# EAGLE design FLC-148 ptt panel (EAGLE 9.4.0)
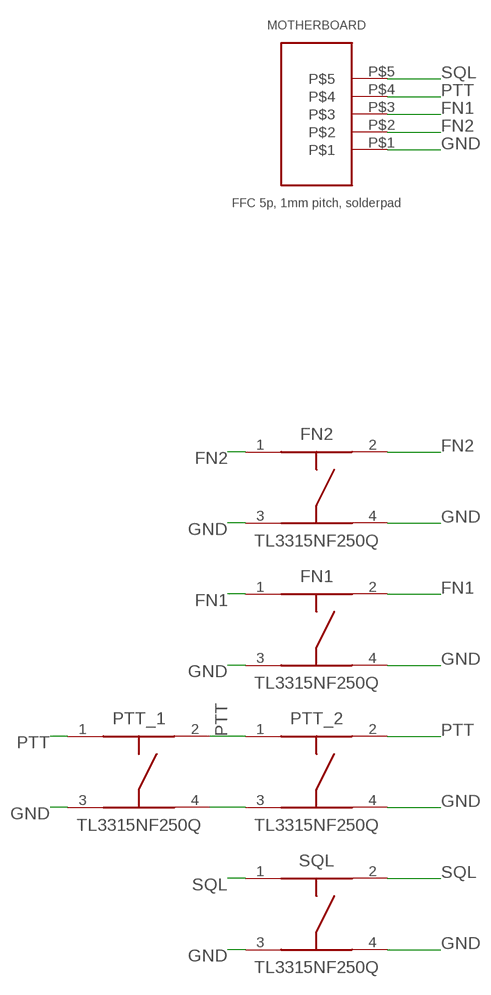
[diagram p0: schematic, sheet 1]

## Parts
FN1  TL3315NF250Q  [SMT]
FN2  TL3315NF250Q  [SMT]
MOTHERBOARD  FFC 5p, 1mm pitch, solderpad  FFC_1MM_5P  [FFC_1MM_5P]
PTT_1  TL3315NF250Q  [SMT]
PTT_2  TL3315NF250Q  [SMT]
SQL  TL3315NF250Q  [SMT]

## Nets
FN1: FN1.1 FN1.2 MOTHERBOARD.P$3
FN2: FN2.1 FN2.2 MOTHERBOARD.P$2
GND: FN1.3 FN1.4 FN2.3 FN2.4 MOTHERBOARD.P$1 PTT_1.3 PTT_1.4 PTT_2.3 PTT_2.4 SQL.3 SQL.4
PTT [signal]: MOTHERBOARD.P$4 PTT_1.1 PTT_1.2 PTT_2.1 PTT_2.2
SQL: MOTHERBOARD.P$5 SQL.1 SQL.2

## Library data of the parts
FN1 FN2 PTT_1 PTT_2 SQL = TL3315-345930 SMT Tact Pushbutton:TL3315NF250Q
MOTHERBOARD = FFC solder pad pitch 1mm 5p:FFC_1MM_5P

## Net classes
0 GND: width 0.3 mm, drill 0.35 mm, clearance 0.3 mm
1 signal: width 0.3 mm, drill 0.35 mm, clearance 0.3 mm

## Board
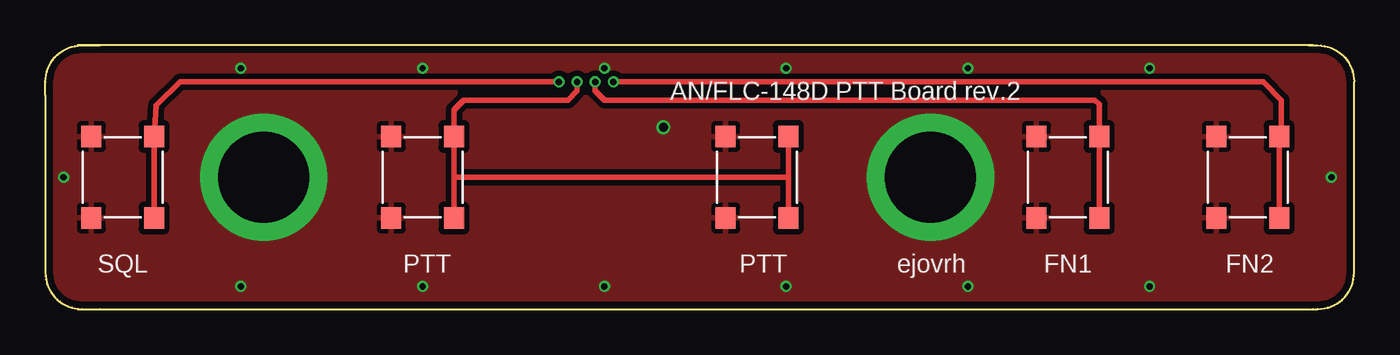
[diagram p1: board, top side]
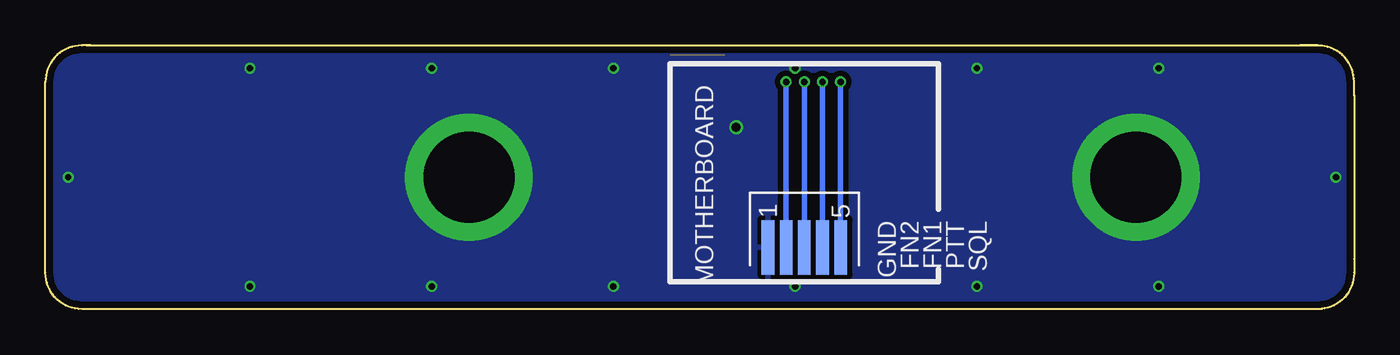
[diagram p2: board, bottom side, seen from below]

Size 72 x 14.5 mm. Coordinates in mm from the lower left corner, seen from the top.
Outline: 69.75,14.5 69.5,14.5
Outline: 69.5,14.5 3,14.5
Outline: 3,14.5 1.75,14.5
Outline: 1.75,0 3,0
Outline: 3,0 69.75,0 70,0 arc90 72,2 72,12.5 arc90 70,14.5 69.5,14.5
Outline: 3,14.5 2,14.5 arc90 0,12.5 0,11.75 0,2.75 0,2 arc90 2,0 3,0
Copper layers (1*16): Top 0.035559375mm / dielectric 1.6mm / Bottom 0.035559375mm
Design rules "oshpark-2layer": minimum track width 6mil, minimum drill 10mil, track to track 6mil, track to pad 6mil, pad to pad 6mil, via to via 6mil, smd to smd 6mil, copper to edge 15mil, drill to drill 6mil, minimum pad ring 5mil, minimum via ring 5mil, stop-mask expansion 2.5mil, vias tented up to drill 0mil, thermal gap 10mil

### Footprints (pad centres in the part's own frame; a part is rotated, then mirrored left to right if it is on the bottom)
SMT = smd 1.2 x 1.1: 1 -2.238,1.723; 2 2.238,1.723; 3 -2.238,-1.723; 4 2.238,-1.723
FFC_1MM_5P = smd 3 x 0.7: P$1 0,-2; P$2 0,-1; P$3 0,0; P$4 0,1; P$5 0,2

### Placement (x,y rotation side)
FN1  56.25,7.25 270 top
FN2  66.15,7.25 270 top
MOTHERBOARD  30.25,3.4 270 bottom
PTT_1  20.75,7.25 270 top
PTT_2  39.15,7.25 270 top
SQL  4.25,7.25 270 top

### Tracks (layer width: path | path; a pad name or v marks a point on that pad's centre or on a via)
FN1  (via drill 0.35)
  Top 0.3: v30.25,12.5 30.25,12 30.75,11.5 57.75,11.5 57.97,11.28 FN1.1 FN1.2
  Bottom 0.3: MOTHERBOARD.P$3 v30.25,12.5
FN2  (via drill 0.35)
  Top 0.3: v31.25,12.5 67,12.5 68,11.5 68,9.62 FN2.1 FN2.2
  Bottom 0.3: MOTHERBOARD.P$2 v31.25,12.5
GND  (via drill 0.35, 0.5, 5 pad 7)
  other vias: 12,7.25 48.7,7.25 34,10 50.75,1.25 10.75,1.25 1,7.25 10.75,13.25 70.75,7.25 30.75,1.25 30.75,13.25 20.75,1.25 40.75,1.25 60.75,1.25 60.75,13.25 50.75,13.25 40.75,13.25 20.75,13.25
  pour Top: -2.25,16.25 73.75,16.25 73.75,-1.75 -2.25,-1.75
  pour Bottom: -2.25,16.25 73.75,16.25 73.75,-1.75 -2.25,-1.75
PTT  (via drill 0.35)
  Top 0.3: v29.25,12.5 29.25,12 28.75,11.5 23,11.5 22.47,10.97 PTT_1.1 22.47,7.25 | PTT_2.2 40.87,7.25 | 40.87,7.25 PTT_2.1 | PTT_1.2 22.47,7.25 | 22.47,7.25 40.87,7.25
  Bottom 0.3: MOTHERBOARD.P$4 v29.25,12.5
SQL  (via drill 0.35)
  Top 0.3: v28.25,12.5 7.4,12.5 6.1,11.2 SQL.1 SQL.2
  Bottom 0.3: MOTHERBOARD.P$5 v28.25,12.5

### Text on the board
tNames: AN/FLC-148D PTT Board rev.2 | PTT | PTT | ejovrh
bNames: SQL | PTT | FN1 | FN2 | GND